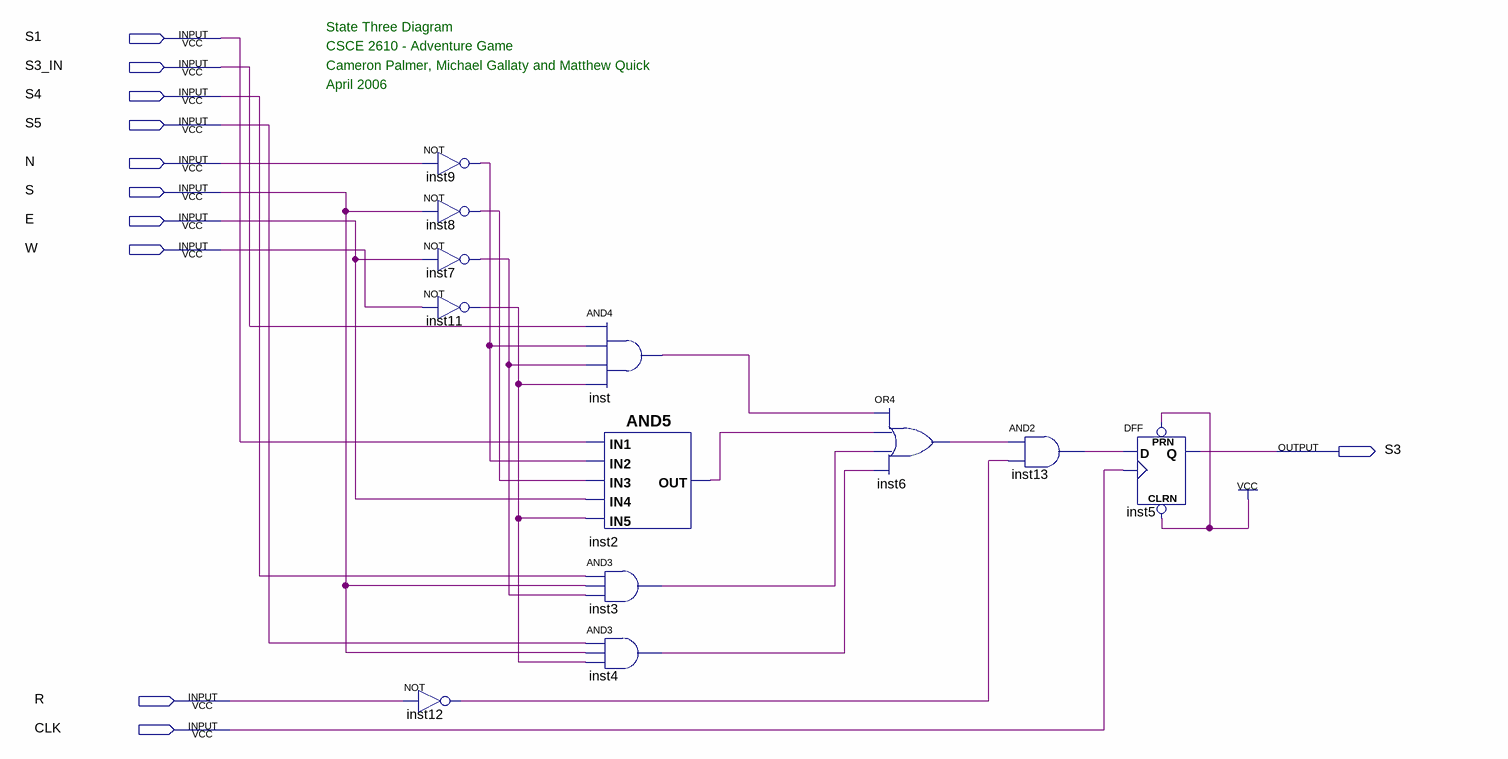
[diagram p0: schematic sheet]
// Quartus schematic state_three.bdf as structural Verilog: 12 symbols, 11 pins
module state_three (
  input  S1,
  input  S3_IN,
  input  S4,
  input  S5,
  input  N,
  input  S,
  input  E,
  input  W,
  input  R,
  input  CLK,
  output S3
);

  wire inst2_out, inst3_out, inst4_out, inst6_out, inst7_out, inst8_out, inst9_out, inst11_out, inst12_out,
       inst13_out, inst_out;

  not inst12 (inst12_out, R);
  not inst9 (inst9_out, N);
  not inst8 (inst8_out, S);
  not inst7 (inst7_out, E);
  not inst11 (inst11_out, W);
  and inst (inst_out, S3_IN, inst9_out, inst7_out, inst11_out);
  and inst2 (inst2_out, S1, inst9_out, inst8_out, E, inst11_out);
  and inst3 (inst3_out, S4, S, inst7_out);
  and inst4 (inst4_out, S5, S, inst11_out);
  or inst6 (inst6_out, inst_out, inst2_out, inst3_out, inst4_out);
  and inst13 (inst13_out, inst6_out, inst12_out);
  DFF inst5 (.CLRN(1'b1), .CLK(CLK), .D(inst13_out), .PRN(1'b1), .Q(S3));

  // Notes on the sheet:
  //   State Three Diagram
  //   CSCE 2610 - Adventure Game
  //   Cameron Palmer, Michael Gallaty and Matthew Quick
  //   April 2006
endmodule
